# Altium project LKS_EVB_MCU074D_V1.0.PrjPcb
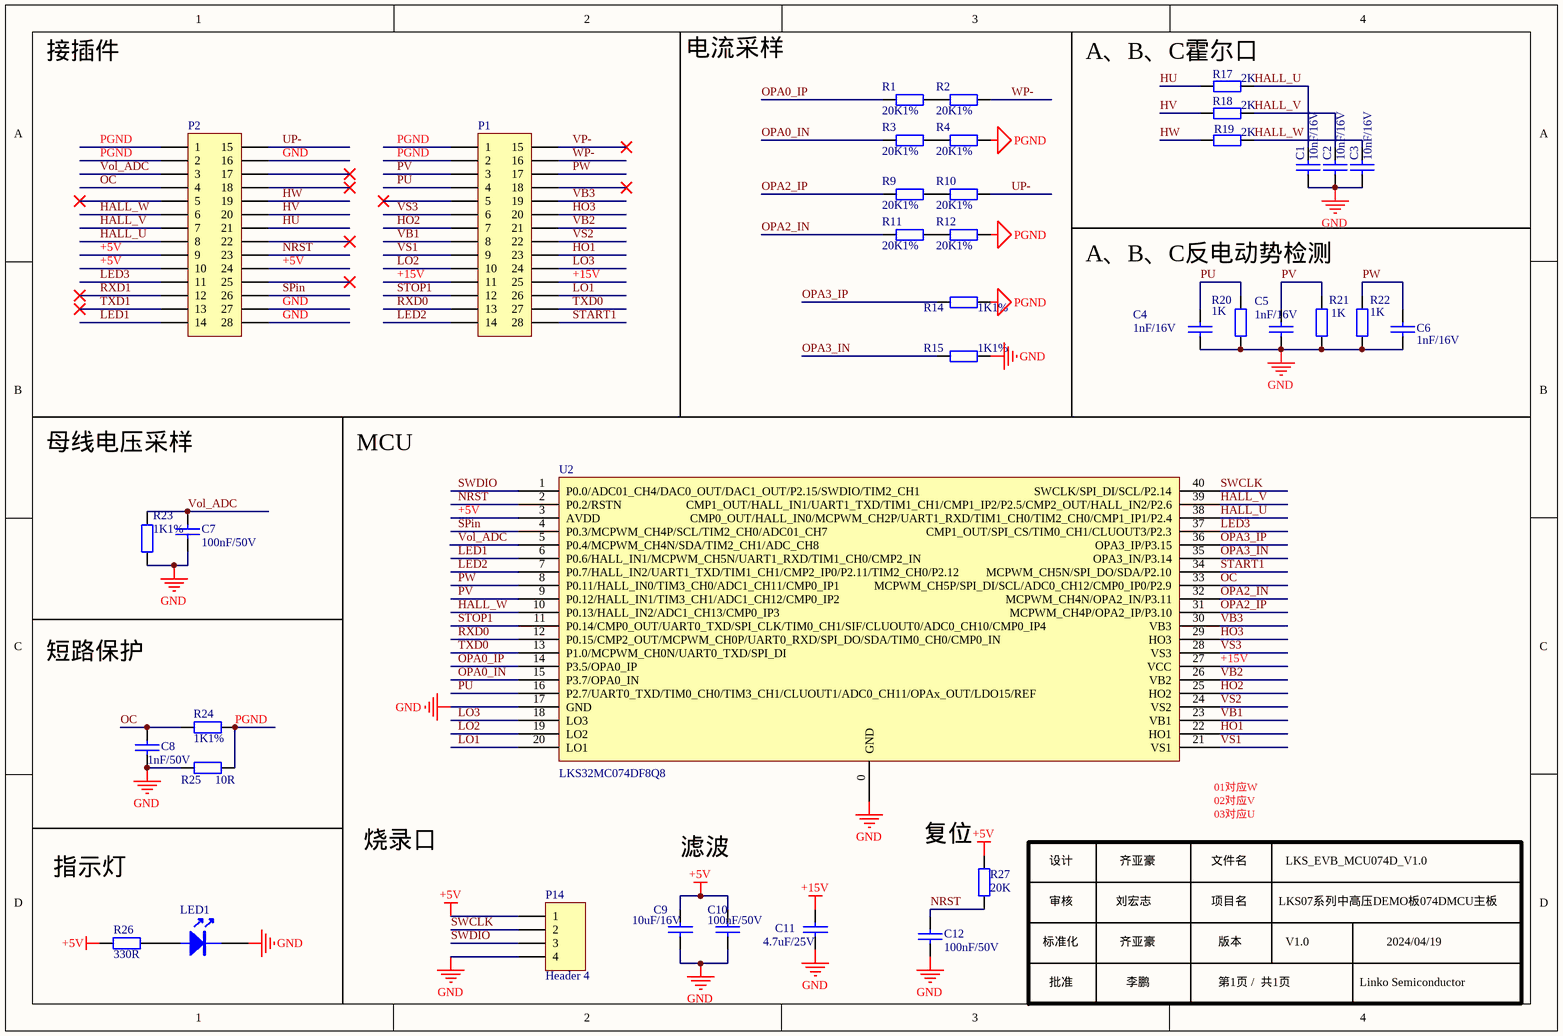
[diagram p0: LKS_EVB_MCU074D_V1.0.SchDoc]
1 sheet, 38 parts. Net scope: global (net labels, ports and power ports of the same name join across sheets).
Board file: LKS_EVB_MCU074D_V1.0.PcbDoc

## Sheet LKS_EVB_MCU074D_V1.0.SchDoc
size A4; SheetNumber: 1; SheetTotal: 1

### Parts
C1  10nF/16V  [0603C]
C2  10nF/16V  [0603C]
C3  10nF/16V  [0603C]
C4  1nF/16V  [0603C]
C5  1nF/16V  [0603C]
C6  1nF/16V  [0603C]
C7  100nF/50V  [0603C]
C8  1nF/50V  [0603C]
C9  10uF/16V  [0603C]
C10  100nF/50V  [0603C]
C11  4.7uF/25V  [0603C]
C12  100nF/50V  [0603C]
LED1  LED  [LED 0603R]  (value not drawn)
P1  Header 14X2A  [HDR 2X14 底层]  (value not drawn)
P2  Header 14X2A  [HDR 2X14 底层]  (value not drawn)
P14  Header 4  [HDR1X4]
R1  20K1%  [0603R]
R2  20K1%  [0603R]
R3  20K1%  [0603R]
R4  20K1%  [0603R]
R9  20K1%  [0603R]
R10  20K1%  [0603R]
R11  20K1%  [0603R]
R12  20K1%  [0603R]
R14  1K1%  [0603R]
R15  1K1%  [0603R]
R17  2K  [0603R]
R18  2K  [0603R]
R19  2K  [0603R]
R20  1K  [0603R]
R21  1K  [0603R]
R22  1K  [0603R]
R23  1K1%  [0603R]
R24  1K1%  [0603R]
R25  10R  [0603R]
R26  330R  [0603R]
R27  20K  [0603R]
U2  LKS32MC074DF8Q8  [QFN40]

### Nets
+5V: C9.2 C10.2 P2.9 P2.10 P2.24 P14.1 R26.2 R27.2 U2.3(AVDD)
+15V: C11.2 P1.11 P1.25 U2.27(VCC)
GND: C1.2 C2.2 C3.2 C4.2 C5.2 C6.2 C7.1 C8.1 C9.1 C10.1 C11.1 C12.2 LED1.2(K) P2.16 P2.27 P2.28 P14.4 R15.1 R20.2 R21.2 R22.2 R23.1 R25.2 U2.0(GND) U2.17(GND)
PGND: P1.1 P1.2 P2.1 P2.2 R4.1 R12.1 R14.1 R24.2 R25.1
HALL_U: C1.1 P2.8 R17.2 U2.38(CMP0_OUT/HALL_IN0/MCPWM_CH2P/UART1_RXD/TIM1_CH0/TIM2_CH0/CMP1_IP1/P2.4)
HALL_V: C2.1 P2.7 R18.2 U2.39(CMP1_OUT/HALL_IN1/UART1_TXD/TIM1_CH1/CMP1_IP2/P2.5/CMP2_OUT/HALL_IN2/P2.6)
HALL_W: C3.1 P2.6 R19.2 U2.10(P0.13/HALL_IN2/ADC1_CH13/CMP0_IP3)
HO1: P1.23 U2.22(HO1)
HO2: P1.7 U2.25(HO2)
HO3: P1.20 U2.29(HO3)
HU: P2.21 R17.1
HV: P2.20 R18.1
HW: P2.19 R19.1
LED1: P2.14 U2.6(P0.6/HALL_IN1/MCPWM_CH5N/UART1_RXD/TIM1_CH0/CMP2_IN)
LED2: P1.14 U2.7(P0.7/HALL_IN2/UART1_TXD/TIM1_CH1/CMP2_IP0/P2.11/TIM2_CH0/P2.12)
LED3: P2.11 U2.37(CMP1_OUT/SPI_CS/TIM0_CH1/CLUOUT3/P2.3)
LO1: P1.26 U2.20(LO1)
LO2: P1.10 U2.19(LO2)
LO3: P1.24 U2.18(LO3)
NRST: C12.1 P2.23 R27.1 U2.2(P0.2/RSTN)
OC: C8.2 P2.4 R24.1 U2.33(MCPWM_CH5P/SPI_DI/SCL/ADC0_CH12/CMP0_IP0/P2.9)
OPA0_IN: R3.2 U2.15(P3.7/OPA0_IN)
OPA0_IP: R1.2 U2.14(P3.5/OPA0_IP)
OPA2_IN: R11.2 U2.32(MCPWM_CH4N/OPA2_IN/P3.11)
OPA2_IP: R9.2 U2.31(MCPWM_CH4P/OPA2_IP/P3.10)
OPA3_IN: R15.2 U2.35(OPA3_IN/P3.14)
OPA3_IP: R14.2 U2.36(OPA3_IP/P3.15)
PU: C4.1 P1.4 R20.1 U2.16(P2.7/UART0_TXD/TIM0_CH0/TIM3_CH1/CLUOUT1/ADC0_CH11/OPAx_OUT/LDO15/REF)
PV: C5.1 P1.3 R21.1 U2.9(P0.12/HALL_IN1/TIM3_CH1/ADC1_CH12/CMP0_IP2)
PW: C6.1 P1.17 R22.1 U2.8(P0.11/HALL_IN0/TIM3_CH0/ADC1_CH11/CMP0_IP1)
RXD0: P1.13 U2.12(P0.15/CMP2_OUT/MCPWM_CH0P/UART0_RXD/SPI_DO/SDA/TIM0_CH0/CMP0_IN)
RXD1: P2.12
SPin: P2.26 U2.4(P0.3/MCPWM_CH4P/SCL/TIM2_CH0/ADC01_CH7)
START1: P1.28 U2.34(MCPWM_CH5N/SPI_DO/SDA/P2.10)
STOP1: P1.12 U2.11(P0.14/CMP0_OUT/UART0_TXD/SPI_CLK/TIM0_CH1/SIF/CLUOUT0/ADC0_CH10/CMP0_IP4)
SWCLK: P14.2 U2.40(SWCLK/SPI_DI/SCL/P2.14)
SWDIO: P14.3 U2.1(P0.0/ADC01_CH4/DAC0_OUT/DAC1_OUT/P2.15/SWDIO/TIM2_CH1)
TXD0: P1.27 U2.13(P1.0/MCPWM_CH0N/UART0_TXD/SPI_DI)
TXD1: P2.13
UP-: P2.15 R10.1
VB1: P1.8 U2.23(VB1)
VB2: P1.21 U2.26(VB2)
VB3: P1.19 U2.30(VB3)
Vol_ADC: C7.2 P2.3 R23.2 U2.5(P0.4/MCPWM_CH4N/SDA/TIM2_CH1/ADC_CH8)
VP-: P1.15
VS1: P1.9 U2.21(VS1)
VS2: P1.22 U2.24(VS2)
VS3: P1.6 U2.28(VS3)
WP-: P1.16 R2.1
NetLED1_1: LED1.1(A) R26.1
NetR1_1: R1.1 R2.2
NetR3_1: R3.1 R4.2
NetR9_1: R9.1 R10.2
NetR11_1: R11.1 R12.2

Not connected (* = marked no-connect by the designer): P1 5* 18*; P2 5* 17* 18* 22* 25*

### Notes on the sheet
- 接插件
- 母线电压采样
- 短路保护
- (near U2) 01对应W
- 烧录口
- 复位
- (near U2) 02对应V
- 03对应U
- 指示灯
- 滤波
- 设计
- 审核
- 刘宏志
- 齐亚豪
- 文件名
- 项目名
- LKS07系列中高压DEMO板074DMCU主板
- LKS_EVB_MCU074D_V1.0
- 标准化
- 批准
- 李鹏
- 版本
- 第1页 /  共1页
- V1.0
- Linko Semiconductor
- 2024/04/19
- Labels drawn without touching a wire or pin: A、B、C反电动势检测, A、B、C霍尔口, MCU, 电流采样

### Library data of the parts
C1-C6 = CAP: Capacitor
C7-C12 = C: Capacitor
LED1 = LED: LED_Light
P1 P2 = Header 14X2A: Header, 14-Pin, Dual row; LatestRevisionDate: 17-Jul-2002; LatestRevisionNote: Re-released for DXP Platform.; Publisher: Altium Limited
P14 = Header 4: Header, 4-Pin; LatestRevisionDate: 17-Jul-2002; LatestRevisionNote: Re-released for DXP Platform.; Publisher: Altium Limited
R1-R4 R9-R12 R14 R15 R17-R25 R27 = Res: Resistor; Value: K; Published: 8-Jun-2000; LatestRevisionDate: 17-Jul-2002; LatestRevisionNote: Re-released for DXP Platform.; PackageReference: AXIAL-0.4; Publisher: Altium Limited; PackageDescription: Axial Device, Thru-Hole; 2 Leads; 0.4 in Pin Spacing
R26 = Res: Resistor; Value: 330; Published: 8-Jun-2000; LatestRevisionDate: 17-Jul-2002; LatestRevisionNote: Re-released for DXP Platform.; PackageReference: AXIAL-0.4; Publisher: Altium Limited; PackageDescription: Axial Device, Thru-Hole; 2 Leads; 0.4 in Pin Spacing
U2 = LKS32MC074DF8Q8: 芯片